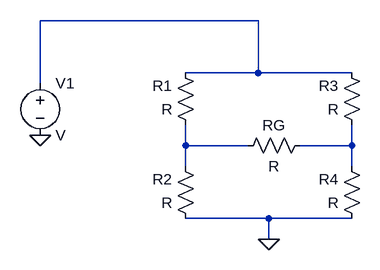
[diagram p0: schematic simulacion_puente.asc]
simulacion_puente.asc, the LTspice schematic file:
Version 4
SHEET 1 880 680
WIRE 384 48 48 48
WIRE 384 128 384 48
WIRE 384 128 272 128
WIRE 528 128 384 128
WIRE 48 144 48 48
WIRE 272 240 272 208
WIRE 368 240 272 240
WIRE 528 240 528 208
WIRE 528 240 448 240
WIRE 272 272 272 240
WIRE 528 272 528 240
WIRE 400 352 272 352
WIRE 528 352 400 352
WIRE 400 384 400 352
FLAG 48 224 0
FLAG 400 384 0
SYMBOL voltage 48 128 R0
SYMATTR InstName V1
SYMBOL res 288 224 R180
WINDOW 0 36 76 Left 2
WINDOW 3 36 40 Left 2
SYMATTR InstName R1
SYMBOL res 288 368 R180
WINDOW 0 36 76 Left 2
WINDOW 3 36 40 Left 2
SYMATTR InstName R2
SYMBOL res 544 224 R180
WINDOW 0 36 76 Left 2
WINDOW 3 36 40 Left 2
SYMATTR InstName R3
SYMBOL res 544 368 R180
WINDOW 0 36 76 Left 2
WINDOW 3 36 40 Left 2
SYMATTR InstName R4
SYMBOL res 464 224 R90
WINDOW 0 0 56 VBottom 2
WINDOW 3 32 56 VTop 2
SYMATTR InstName RG

The netlist it stands for:
* simulacion_puente.asc
V1 N001 0 V
R1 N002 N001 R
R2 0 N002 R
R3 N003 N001 R
R4 0 N003 R
RG N003 N002 R
.backanno
.end